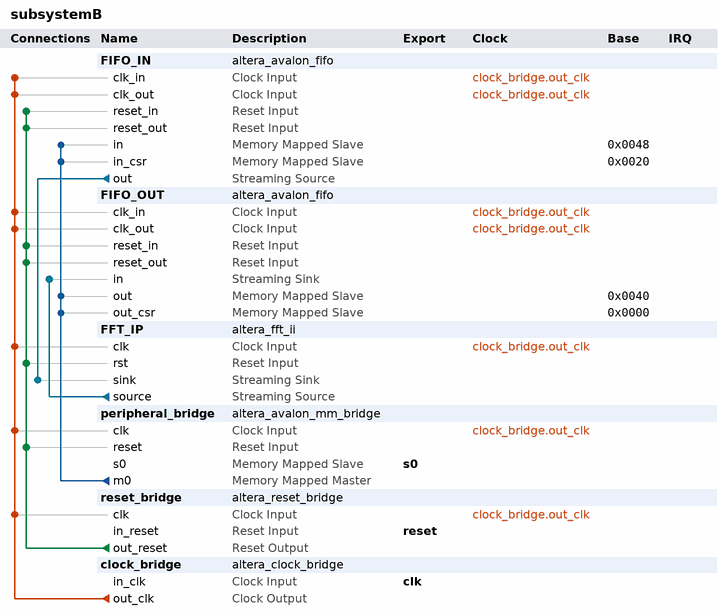
[diagram p0: system contents]
# Platform Designer (Qsys) system subsystemB, MAX 10 10M50DAF484C7G
# Parameters at their usual value, and those the tool derives, are not listed.
package require -exact qsys 18.1
create_system subsystemB
set_project_property DEVICE_FAMILY {MAX 10}
set_project_property DEVICE 10M50DAF484C7G

add_instance FIFO_IN altera_avalon_fifo 18.1
set_instance_parameter_value FIFO_IN bitsPerSymbol 25
set_instance_parameter_value FIFO_IN channelWidth 0
set_instance_parameter_value FIFO_IN errorWidth 0
set_instance_parameter_value FIFO_IN fifoDepth 128
set_instance_parameter_value FIFO_IN fifoInputInterfaceOptions AVALONMM_WRITE
set_instance_parameter_value FIFO_IN fifoOutputInterfaceOptions AVALONST_SOURCE
set_instance_parameter_value FIFO_IN singleClockMode false
set_instance_parameter_value FIFO_IN symbolsPerBeat 1
set_instance_parameter_value FIFO_IN useIRQ false
set_instance_parameter_value FIFO_IN usePacket true
set_instance_parameter_value FIFO_IN useReadControl false

add_instance FIFO_OUT altera_avalon_fifo 18.1
set_instance_parameter_value FIFO_OUT bitsPerSymbol 30
set_instance_parameter_value FIFO_OUT channelWidth 0
set_instance_parameter_value FIFO_OUT errorWidth 0
set_instance_parameter_value FIFO_OUT fifoDepth 128
set_instance_parameter_value FIFO_OUT fifoInputInterfaceOptions AVALONST_SINK
set_instance_parameter_value FIFO_OUT fifoOutputInterfaceOptions AVALONMM_READ
set_instance_parameter_value FIFO_OUT singleClockMode false
set_instance_parameter_value FIFO_OUT symbolsPerBeat 1
set_instance_parameter_value FIFO_OUT useIRQ false
set_instance_parameter_value FIFO_OUT usePacket true
set_instance_parameter_value FIFO_OUT useReadControl true
set_instance_parameter_value FIFO_OUT useWriteControl false

add_instance FFT_IP altera_fft_ii 18.1
set_instance_parameter_value FFT_IP data_flow Streaming
set_instance_parameter_value FFT_IP data_rep {Block Floating Point}
set_instance_parameter_value FFT_IP engine_arch {Quad Output}
set_instance_parameter_value FFT_IP in_width 12
set_instance_parameter_value FFT_IP length 64
set_instance_parameter_value FFT_IP out_order Natural
set_instance_parameter_value FFT_IP out_width 29
set_instance_parameter_value FFT_IP twid_width 12

add_instance peripheral_bridge altera_avalon_mm_bridge 18.1
set_instance_parameter_value peripheral_bridge ADDRESS_UNITS SYMBOLS
set_instance_parameter_value peripheral_bridge ADDRESS_WIDTH 10
set_instance_parameter_value peripheral_bridge DATA_WIDTH 32
set_instance_parameter_value peripheral_bridge MAX_PENDING_RESPONSES 4
set_instance_parameter_value peripheral_bridge USE_AUTO_ADDRESS_WIDTH 0

add_instance reset_bridge altera_reset_bridge 18.1
set_instance_parameter_value reset_bridge ACTIVE_LOW_RESET 0
set_instance_parameter_value reset_bridge SYNCHRONOUS_EDGES deassert

add_instance clock_bridge altera_clock_bridge 18.1
set_instance_parameter_value clock_bridge DERIVED_CLOCK_RATE 0
set_instance_parameter_value clock_bridge EXPLICIT_CLOCK_RATE 0

# connections
add_connection clock_bridge.out_clk FFT_IP.clk clock
add_connection clock_bridge.out_clk FIFO_IN.clk_in clock
add_connection clock_bridge.out_clk FIFO_IN.clk_out clock
add_connection clock_bridge.out_clk FIFO_OUT.clk_in clock
add_connection clock_bridge.out_clk FIFO_OUT.clk_out clock
add_connection clock_bridge.out_clk peripheral_bridge.clk clock
add_connection clock_bridge.out_clk reset_bridge.clk clock
add_connection reset_bridge.out_reset FFT_IP.rst reset
add_connection reset_bridge.out_reset FIFO_IN.reset_in reset
add_connection reset_bridge.out_reset FIFO_IN.reset_out reset
add_connection reset_bridge.out_reset FIFO_OUT.reset_in reset
add_connection reset_bridge.out_reset FIFO_OUT.reset_out reset
add_connection reset_bridge.out_reset peripheral_bridge.reset reset
add_connection peripheral_bridge.m0 FIFO_IN.in avalon
set_connection_parameter_value peripheral_bridge.m0/FIFO_IN.in baseAddress 0x0048
add_connection peripheral_bridge.m0 FIFO_IN.in_csr avalon
set_connection_parameter_value peripheral_bridge.m0/FIFO_IN.in_csr baseAddress 0x0020
add_connection peripheral_bridge.m0 FIFO_OUT.out avalon
set_connection_parameter_value peripheral_bridge.m0/FIFO_OUT.out baseAddress 0x0040
add_connection peripheral_bridge.m0 FIFO_OUT.out_csr avalon
set_connection_parameter_value peripheral_bridge.m0/FIFO_OUT.out_csr baseAddress 0x0000
add_connection FFT_IP.source FIFO_OUT.in avalon_streaming
add_connection FIFO_IN.out FFT_IP.sink avalon_streaming

# exported interfaces
add_interface clk clock sink
set_interface_property clk EXPORT_OF clock_bridge.in_clk
add_interface reset reset sink
set_interface_property reset EXPORT_OF reset_bridge.in_reset
add_interface s0 avalon slave
set_interface_property s0 EXPORT_OF peripheral_bridge.s0

set_interconnect_requirement {$system} qsys_mm.clockCrossingAdapter HANDSHAKE
set_interconnect_requirement {$system} qsys_mm.enableEccProtection FALSE
set_interconnect_requirement {$system} qsys_mm.insertDefaultSlave FALSE
set_interconnect_requirement {$system} qsys_mm.maxAdditionalLatency 1

save_system subsystemB.qsys
